# EAGLE design blumenland (EAGLE 7.2.0)
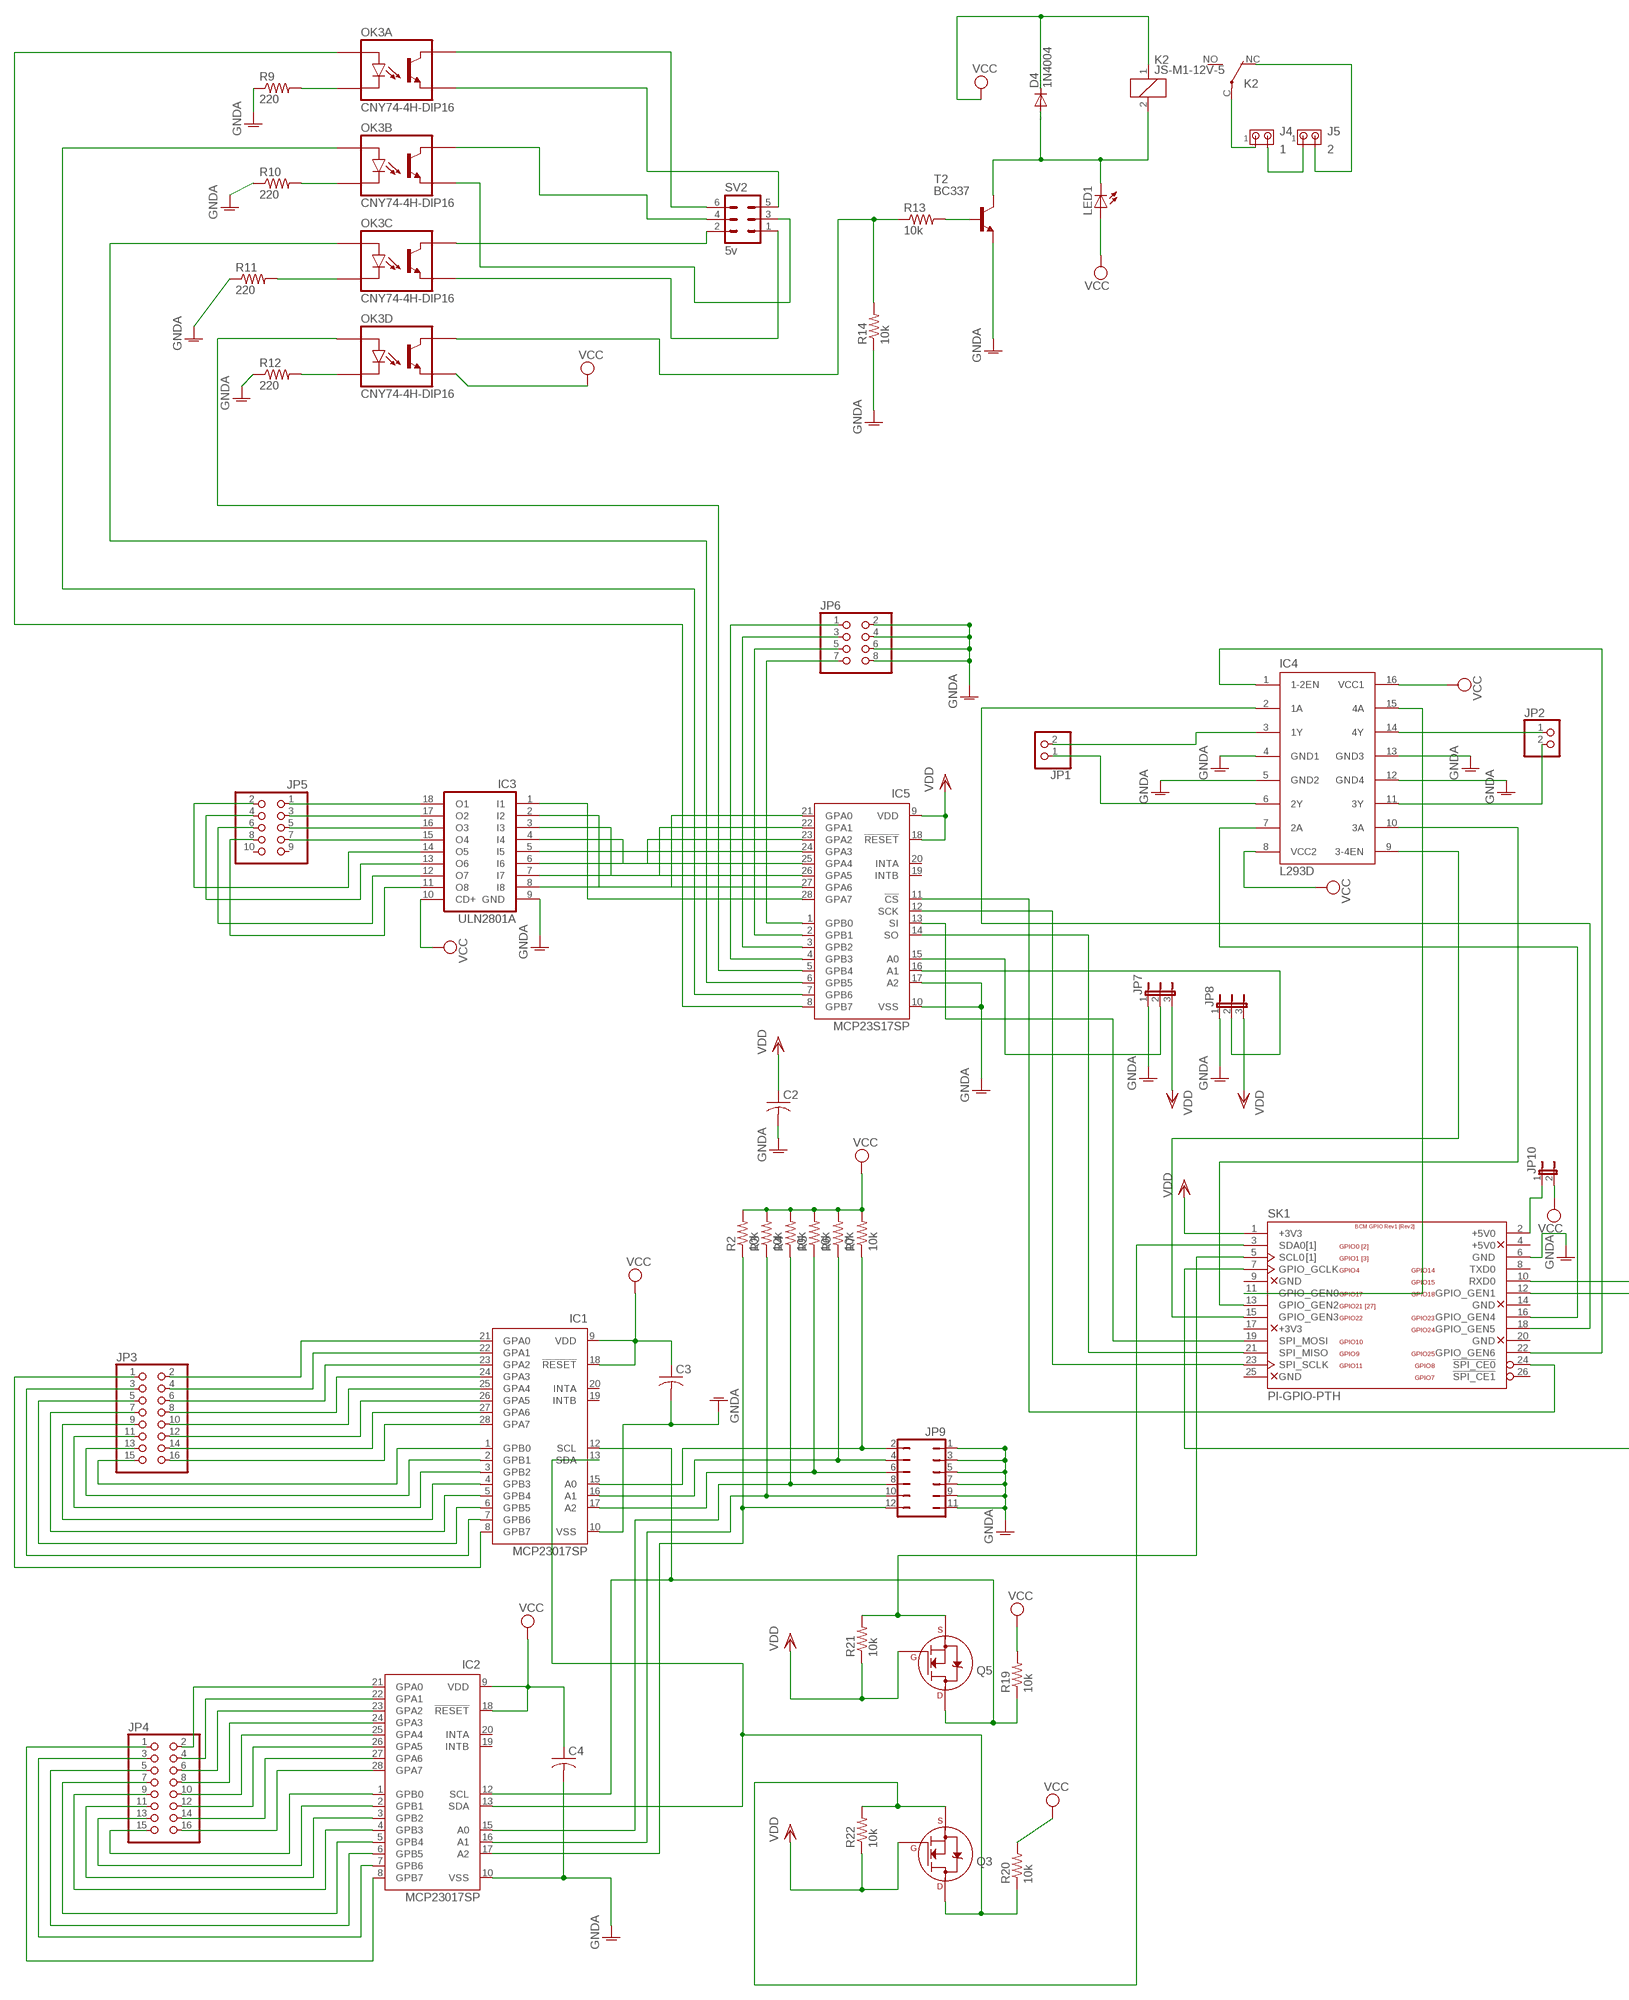
[diagram p0: schematic, sheet 1, part 1 of 2]
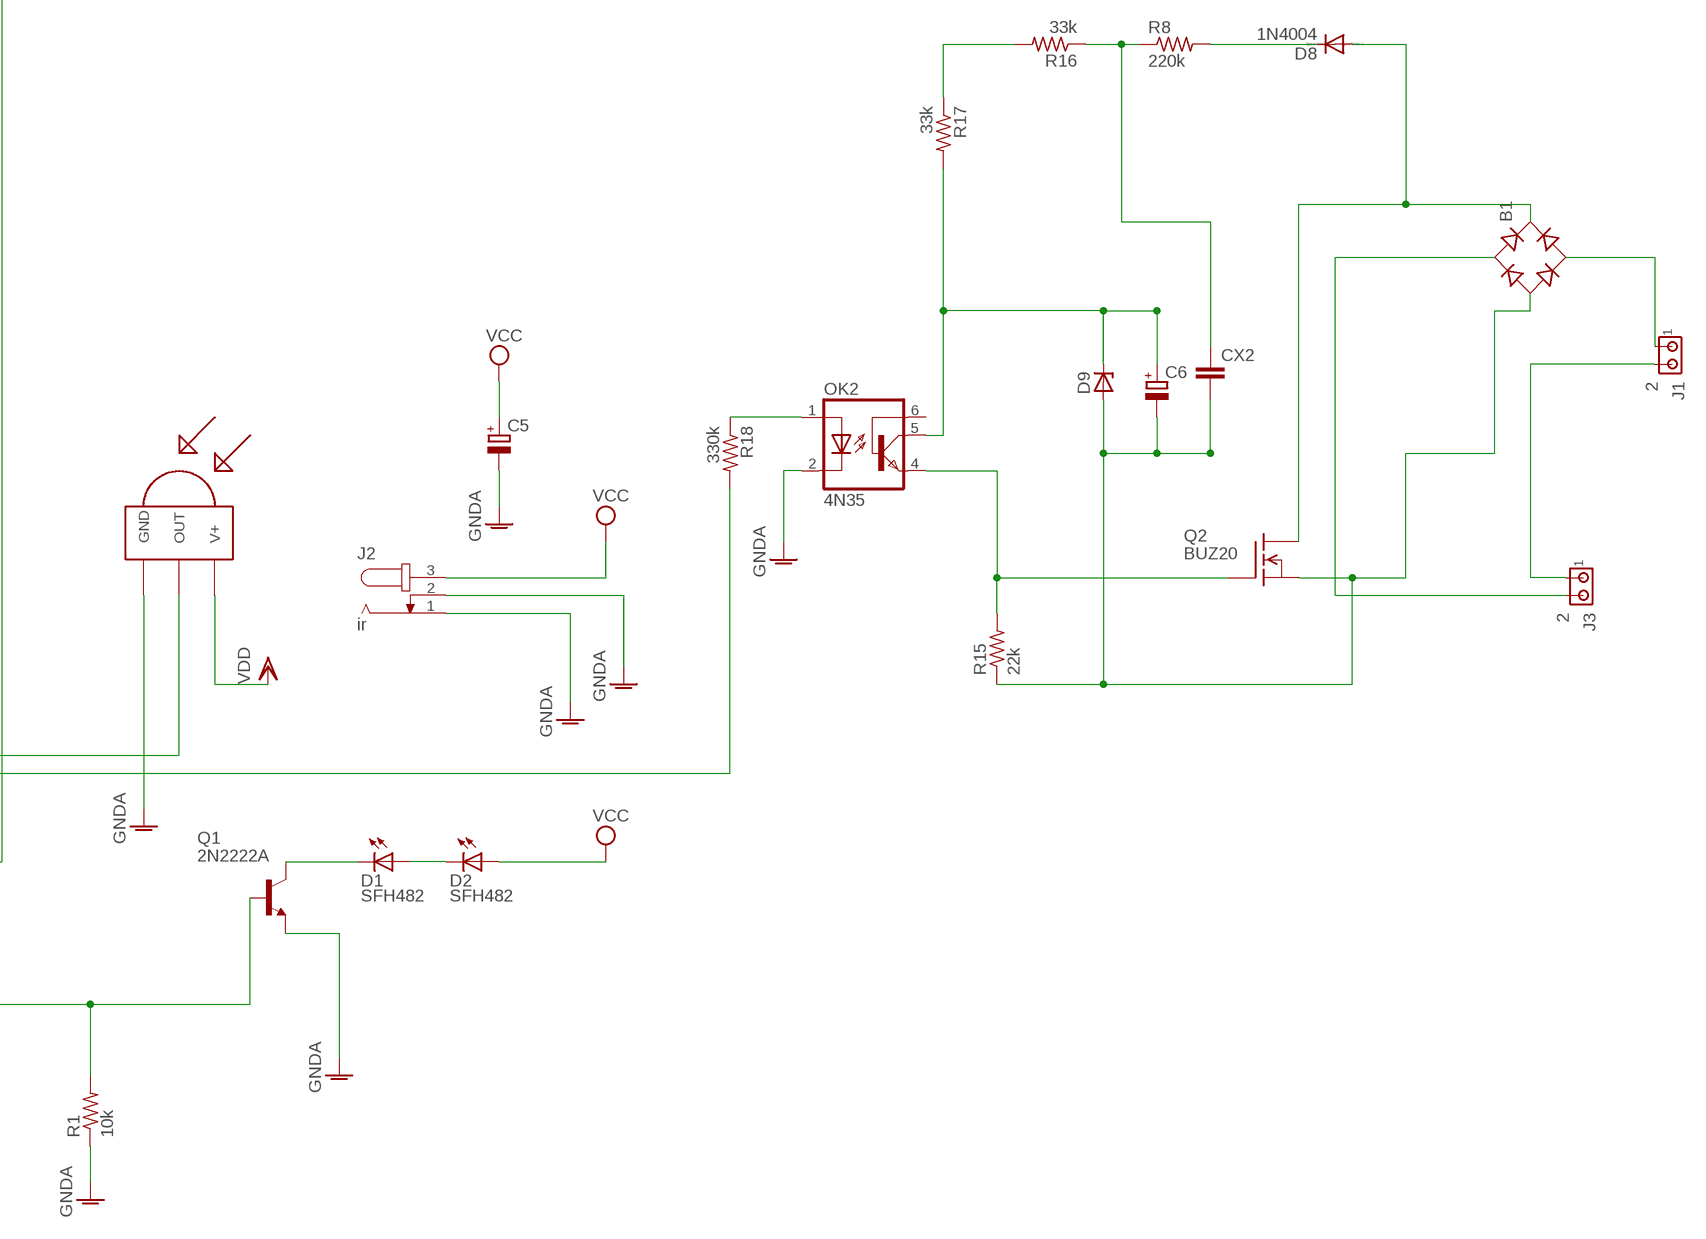
[diagram p1: schematic, sheet 1, part 2 of 2]

## Parts
B1  RB1A  [RB1A]
C2  C-US025-025X050  [C025-025X050]
C3  C-US025-025X050  [C025-025X050]
C4  C-US025-025X050  [C025-025X050]
C5  CPOL-EUE2-5  [E2-5]
C6  CPOL-EUE2.5-5  [E2,5-5]
CX2  CXXC10B6  [XC10B6]
D1  SFH482  [SFH482]
D2  SFH482  [SFH482]
D4  1N4004  [DO41-10]
D8  1N4004  [DO41-10]
D9  ZENER-DIODEDO41Z10  [DO41Z10]
IC1  MCP23017SP  [DIL28-3]
IC2  MCP23017SP  [DIL28-3]
IC3  ULN2801A  [DIL18]
IC4  L293D  [DIL16]
IC5  MCP23S17SP  [DIL28-3]
J1  2  MTA02-156  [1X2MTA]
J2  ir  JACK-PLUG0  [SPC4077]
J3  2  MTA02-156  [1X2MTA]
J4  1  MTA02-156  [1X2MTA]
J5  2  MTA02-156  [1X2MTA]
JP1  PINHD-1X2  [1X02]
JP2  PINHD-1X2  [1X02]
JP3  PINHD-2X8  [2X08]
JP4  PINHD-2X8  [2X08]
JP5  PINHD-2X5  [2X05]
JP6  PINHD-2X4  [2X04]
JP7  JP2E  [JP2]
JP8  JP2E  [JP2]
JP9  JP6Q  [JP6Q]
JP10  JP1E  [JP1]
K2  JS-M1-12V-5  [JS-M]
LED1  LED5MM  [LED5MM]
OK2  4N35  [DIL06]
OK3  CNY74-4H-DIP16  [DIL16-3]
Q1  2N2222A  [TO18]
Q2  BUZ20  [TO220]
Q3  2N7000_TO92  [TO-92]
Q5  2N7000_TO92  [TO-92]
R1  10k  R-US_0207/10  [0207/10]
R2  10k  R-US_0207/10  [0207/10]
R3  10k  R-US_0207/10  [0207/10]
R4  10k  R-US_0207/10  [0207/10]
R5  10k  R-US_0207/10  [0207/10]
R6  10k  R-US_0207/10  [0207/10]
R7  10k  R-US_0207/10  [0207/10]
R8  220k  R-US_0207/10  [0207/10]
R9  220  R-US_0204/7  [0204/7]
R10  220  R-US_0204/7  [0204/7]
R11  220  R-US_0204/7  [0204/7]
R12  220  R-US_0204/7  [0204/7]
R13  10k  R-US_0204/7  [0204/7]
R14  10k  R-US_0204/7  [0204/7]
R15  22k  R-US_0207/10  [0207/10]
R16  33k  R-US_0207/10  [0207/10]
R17  33k  R-US_0207/10  [0207/10]
R18  330k  R-US_0207/10  [0207/10]
R19  10k  R-US_0207/10  [0207/10]
R20  10k  R-US_0207/10  [0207/10]
R21  10k  R-US_0207/10  [0207/10]
R22  10k  R-US_0207/10  [0207/10]
SK1  PI-GPIO-PTH  [GPIO-CONNECTOR]
SV2  5v  MA03-2  [MA03-2]
T2  BC337  [TO92]
U$1  TSOP4838  [TSOP18XX]

## Nets
GNDA: C2.2 C3.2 C4.2 C5.- IC1.10(VSS) IC2.10(VSS) IC3.9(GND) IC4.4(GND1) IC4.5(GND2) IC4.12(GND4) IC4.13(GND3) IC5.10(VSS) IC5.17(A2) J2.1 J2.2 JP6.2 JP6.4 JP6.6 JP6.8 JP7.1 JP8.1 JP9.1 JP9.3 JP9.5 JP9.7 JP9.9 JP9.11 OK2.2(C) Q1.1(E) R1.1 R9.1 R10.1 R11.1 R12.1 R14.1 SK1.6(GND) T2.1(E) U$1.GND
N$1: SK1.10(RXD0) U$1.OUT
N$2: D1.A D2.K(C)
N$3: D1.K(C) Q1.3(C)
N$4: Q1.2(B) R1.2 SK1.7(GPIO_GCLK)
N$5: IC3.1(I1) IC5.28(GPA7)
N$6: IC3.2(I2) IC5.27(GPA6)
N$7: IC3.3(I3) IC5.26(GPA5)
N$8: IC3.4(I4) IC5.25(GPA4)
N$9: IC5.8(GPB7) OK3.1(A:A1)
N$10: IC5.7(GPB6) OK3.4(B:A1)
N$11: IC5.6(GPB5) OK3.5(C:A1)
N$12: IC5.5(GPB4) OK3.8(D:A1)
N$13: IC5.1(GPB0) JP6.7
N$14: IC5.2(GPB1) JP6.5
N$15: IC5.3(GPB2) JP6.3
N$16: IC5.4(GPB3) JP6.1
N$17: IC2.17(A2) JP9.12 R2.1
N$18: IC5.15(A0) JP7.2
N$19: IC5.16(A1) JP8.2
N$20: IC1.15(A0) JP9.2 R7.1
N$21: IC4.1(1-2EN) SK1.22(GPIO_GEN6)
N$22: IC1.16(A1) JP9.4 R6.1
N$23: IC3.5(I5) IC5.24(GPA3)
N$24: IC4.2(1A) SK1.18(GPIO_GEN5)
N$25: IC1.17(A2) JP9.6 R5.1
N$26: IC4.3(1Y) JP1.2
N$27: IC4.6(2Y) JP1.1
N$28: IC4.14(4Y) JP2.1
N$29: IC4.11(3Y) JP2.2
N$30: IC4.7(2A) SK1.16(GPIO_GEN4)
N$31: IC3.6(I6) IC5.23(GPA2)
N$32: IC4.15(4A) SK1.11(GPIO_GEN0)
N$33: IC2.2(GPB1) JP4.13
N$34: IC1.22(GPA1) JP3.4
N$35: IC4.10(3A) SK1.13(GPIO_GEN2)
N$36: IC4.9(3-4EN) SK1.15(GPIO_GEN3)
N$37: IC3.7(I7) IC5.22(GPA1)
N$38: IC3.8(I8) IC5.21(GPA0)
N$39: IC1.21(GPA0) JP3.2
N$40: IC2.15(A0) JP9.8 R4.1
N$41: IC1.23(GPA2) JP3.6
N$42: IC1.24(GPA3) JP3.8
N$43: IC2.16(A1) JP9.10 R3.1
N$44: IC1.25(GPA4) JP3.10
N$45: IC1.26(GPA5) JP3.12
N$46: IC1.27(GPA6) JP3.14
N$47: IC1.28(GPA7) JP3.16
N$48: IC1.2(GPB1) JP3.13
N$49: IC1.1(GPB0) JP3.15
N$50: IC1.3(GPB2) JP3.11
N$51: IC1.4(GPB3) JP3.9
N$52: IC1.5(GPB4) JP3.7
N$53: IC1.6(GPB5) JP3.5
N$54: IC1.7(GPB6) JP3.3
N$55: IC1.8(GPB7) JP3.1
N$56: IC2.21(GPA0) JP4.2
N$57: IC2.22(GPA1) JP4.4
N$58: IC2.23(GPA2) JP4.6
N$59: IC2.24(GPA3) JP4.8
N$60: IC2.25(GPA4) JP4.10
N$61: IC2.26(GPA5) JP4.12
N$62: IC2.27(GPA6) JP4.14
N$63: IC2.28(GPA7) JP4.16
N$64: IC2.1(GPB0) JP4.15
N$65: IC2.3(GPB2) JP4.11
N$66: IC3.18(O1) JP5.1
N$67: IC2.4(GPB3) JP4.9
N$68: IC2.5(GPB4) JP4.7
N$69: IC2.6(GPB5) JP4.5
N$70: IC2.7(GPB6) JP4.3
N$71: IC2.8(GPB7) JP4.1
N$72: IC3.17(O2) JP5.3
N$73: IC3.16(O3) JP5.5
N$74: IC3.15(O4) JP5.7
N$75: IC3.14(O5) JP5.2
N$76: IC5.13(SI) SK1.19(SPI_MOSI)
N$77: IC5.14(SO) SK1.21(SPI_MISO)
N$78: IC5.12(SCK) SK1.23(SPI_SCLK)
N$79: IC5.11(!CS) SK1.24(!SPI_CE0)
N$80: IC3.13(O6) JP5.4
N$81: IC3.12(O7) JP5.6
N$82: IC3.11(O8) JP5.8
N$84: OK3.2(A:C1) R9.2
N$85: OK3.6(C:C1) R11.2
N$86: OK3.3(B:C1) R10.2
N$87: OK3.16(A:EMITTER1) SV2.5
N$88: OK3.13(B:EMITTER1) SV2.3
N$89: OK3.12(C:EMITTER1) SV2.1
N$90: OK3.9(D:COLLECTOR1) R13.1 R14.2
N$91: R13.2 T2.2(B)
N$92: D4.A K2.2 LED1.K(C) T2.3(C)
N$93 [potencia]: J4.1 K2.C(2:P)
N$94: OK3.7(D:C1) R12.2
N$95 [potencia]: J5.2 K2.NC(2:O)
N$96 [potencia]: J4.2 J5.1
N$97: OK3.11(C:COLLECTOR1) SV2.2
N$98: OK3.14(B:COLLECTOR1) SV2.4
N$99: OK3.15(A:COLLECTOR1) SV2.6
N$102: B1.AC1 J3.2
N$103: B1.AC2 J1.1
N$104: B1.+ D8.A Q2.2(D)
N$105: R16.2 R17.1
N$106: CX2.1 R8.1 R16.1
N$107: OK2.4(EMI) Q2.1(G) R15.2
N$109: D8.C R8.2
N$110: C6.+ D9.C OK2.5(COL) R17.2
N$111: R18.2 SK1.12(GPIO_GEN1)
N$112: OK2.1(A) R18.1
N$113: J1.2 J3.1
N$114: JP10.1 SK1.2(+5V0)
N$117: Q5.1(S) R21.2 SK1.5(SCL0)
N$118: Q3.1(S) R22.2 SK1.3(SDA0)
N$119: B1.- C6.- CX2.2 D9.A Q2.3(S) R15.1
N$120: IC1.13(SDA) IC2.13(SDA) Q3.3(D) R20.1
N$121: IC1.12(SCL) IC2.12(SCL) Q5.3(D) R19.1
VCC: C3.1 C4.1 C5.+ D2.A D4.C IC1.9(VDD) IC1.18(!RESET) IC2.9(VDD) IC2.18(!RESET) IC3.10(CD+) IC4.8(VCC2) IC4.16(VCC1) J2.3 JP10.2 K2.1 LED1.A OK3.10(D:EMITTER1) R2.2 R3.2 R4.2 R5.2 R6.2 R7.2 R19.2 R20.2
VDD: C2.1 IC5.9(VDD) IC5.18(!RESET) JP7.3 JP8.3 Q3.2(G) Q5.2(G) R21.1 R22.1 SK1.1(+3V3) U$1.VCC(V+)
Unconnected: IC1.19(INTB) IC1.20(INTA) IC2.19(INTB) IC2.20(INTA) IC5.19(INTB) IC5.20(INTA) JP5.9 JP5.10 K2.NO(2:S) OK2.6(BAS) SK1.4(+5V0) SK1.8(TXD0) SK1.9(GND) SK1.14(GND) SK1.17(+3V3) SK1.20(GND) SK1.25(GND) SK1.26(!SPI_CE1)

## Library data of the parts
B1 = rectifier:RB1A: RECTIFIER 1 A
C2-C4 = rcl:C-US: CAPACITOR, American symbol
C5 C6 = rcl:CPOL-EU: POLARIZED CAPACITOR, European symbol
CX2 = rcl:CX: X CAPACITOR for power line
D1 D2 = led:SFH482: IR LED infrared emitting diode, Infineon
D4 D8 = diode:1N4004: DIODE general purpose rectifier, 1 A
D9 = diode:ZENER-DIODE: Z-Diode
IC1 IC2 = microchip:MCP23017: http://ww1.microchip.com/downloads/en/DeviceDoc/21952a.pdf Source: http://ww1.microchip.com/downloads/en/DeviceDoc/21952a.pdf; MF: MICROCHIP; MPN: MCP23017-E/SP; OC_FARNELL: 1332088; OC_NEWARK: 31K2959
IC3 = uln-udn:ULN2801A: DRIVER ARRAY
IC4 = st-microelectronics:L293D: PUSH-PULL 4 CHANNEL DRIVER; MPN: L293D; OC_FARNELL: 9589619; OC_NEWARK: 56P8249
IC5 = microchip:MCP23S17: http://ww1.microchip.com/downloads/en/DeviceDoc/21952a.pdf Source: http://ww1.microchip.com/downloads/en/DeviceDoc/21952a.pdf; MF: MICROCHIP; MPN: MCP23S17-E/SP; OC_FARNELL: 1292238; OC_NEWARK: 31K2951
J1 J3-J5 = con-amp:MTA02-156: AMP connector
J2 = con-jack:JACK-PLUG: DC POWER JACK Power Jack, DC, Right Angle, Through Hole, Rated 5A at 16VDC, PC Terminals Distributor: Farnell (www.Farnell.de) Drawing: 84N1161.pdf / 84N1162.pdf Manufacturer: SPC Technology (www.spctechnology.com) Type: SPC4077 / SPC 4078; OC_FARNELL: unknown; OC_NEWARK: unknown
JP1 JP2 = pinhead:PINHD-1X2: PIN HEADER
JP3 JP4 = pinhead:PINHD-2X8: PIN HEADER
JP5 = pinhead:PINHD-2X5: PIN HEADER
JP6 = pinhead:PINHD-2X4: PIN HEADER
JP7 JP8 = jumper:JP2E: JUMPER
JP9 = jumper:JP6Q: JUMPER
JP10 = jumper:JP1E: JUMPER
K2 = relay:JS-M1*: Automotive Ultra-Miniature Power Relay NAiS Source: http://www.mew-europe.com/.. en_ds_61211_0000.pdf; MF: FARNELL; MPN: JSM1-12V-5; OC_FARNELL: 910351; OC_NEWARK: 14J1764
LED1 = adafruit:LED: LED OSRAM: - CHIPLED LG R971, LG N971, LY N971, LG Q971, LY Q971, LO R971, LY R971 LH N974, LH R974 LS Q976, LO Q976, LY Q976 LO Q996 - Hyper CHIPLED LW Q18S LB Q993, LB Q99A, LB R99A - SideLED LS A670, LO A670, LY A670, LG A670, LP A670 LB A673, LV A673, LT A673, LW A673 LH A674 LY A675 LS A676, LA A676, LO A676, LY A676, LW A676 LS A679, LY A679, LG A679 - Hyper Micro SIDELED® LS Y876, LA Y876, LO Y876, LY Y876 LT Y87S - SmartLED LW L88C, LW L88S LB L89C, LB L89S, LG L890 LS L89K, LO L89K, LY L89K LS L896, LA L896, LO L896, LY L896 - TOPLED LS T670, LO T670, LY T670, LG T670, LP T670 LSG T670, LSP T670, LSY T670, LOP T670, LYG T670 LG T671, LOG T671, LSG T671 LB T673, LV T673, LT T673, LW T673 LH T674 LS T676, LA T676, LO T676, LY T676, LB T676, LH T676, LSB T676, LW T676 LB T67C, LV T67C, LT T67C, LS T67K, LO T67K, LY T67K, LW E67C LS E67B, LA E67B, LO E67B, LY E67B, LB E67C, LV E67C, LT E67C LW T67C LS T679, LY T679, LG T679 LS T770, LO T770, LY T770, LG T770, LP T770 LB T773, LV T773, LT T773, LW T773 LH T774 LS E675, LA E675, LY E675, LS T675 LS T776, LA T776, LO T776, LY T776, LB T776 LHGB T686 LT T68C, LB T68C - Hyper Mini TOPLED® LB M676 - Mini TOPLED Santana® LG M470 LS M47K, LO M47K, LY M47K Source: http://www.osram.convergy.de/
OK2 = optocoupler:4N35: MOTOROLA OPTO COUPLER; MF: FAIRCHILD SEMICONDUCTOR; MPN: 4N35; OC_FARNELL: 1328375; OC_NEWARK: 72K9946
OK3 = tidyeagle:CNY74-4H: 4-Channel Phototransistor Optocoupler Datasheet: Full <http://www.vishay.com/docs/83526/83526.pdf>
Q1 = transistor-npn:2N2222*: NPN Transistor
Q2 = transistor-fet:BUZ20: N-Channel Enhancement MOSFET 100V; 12A; 0,2Ohm
Q3 Q5 = transistors:2N700*: 2N7000, 2N7002, NDS7002A N-channel enhancement mode MOSFET
R1-R22 = resistor:R-US_: RESISTOR, American symbol
SK1 = jt-raspberry-pi:PI-: Raspberry Pi
SV2 = con-lstb:MA03-2: PIN HEADER; OC_FARNELL: unknown; OC_NEWARK: unknown
T2 = transistor:BC337: NPN TRANSISTOR
U$1 = tsop:TSOP4838: IR Receiver and Demodulator

## Net classes
0 default: width 0.635 mm
1 potencia: width 1.778 mm

## Board
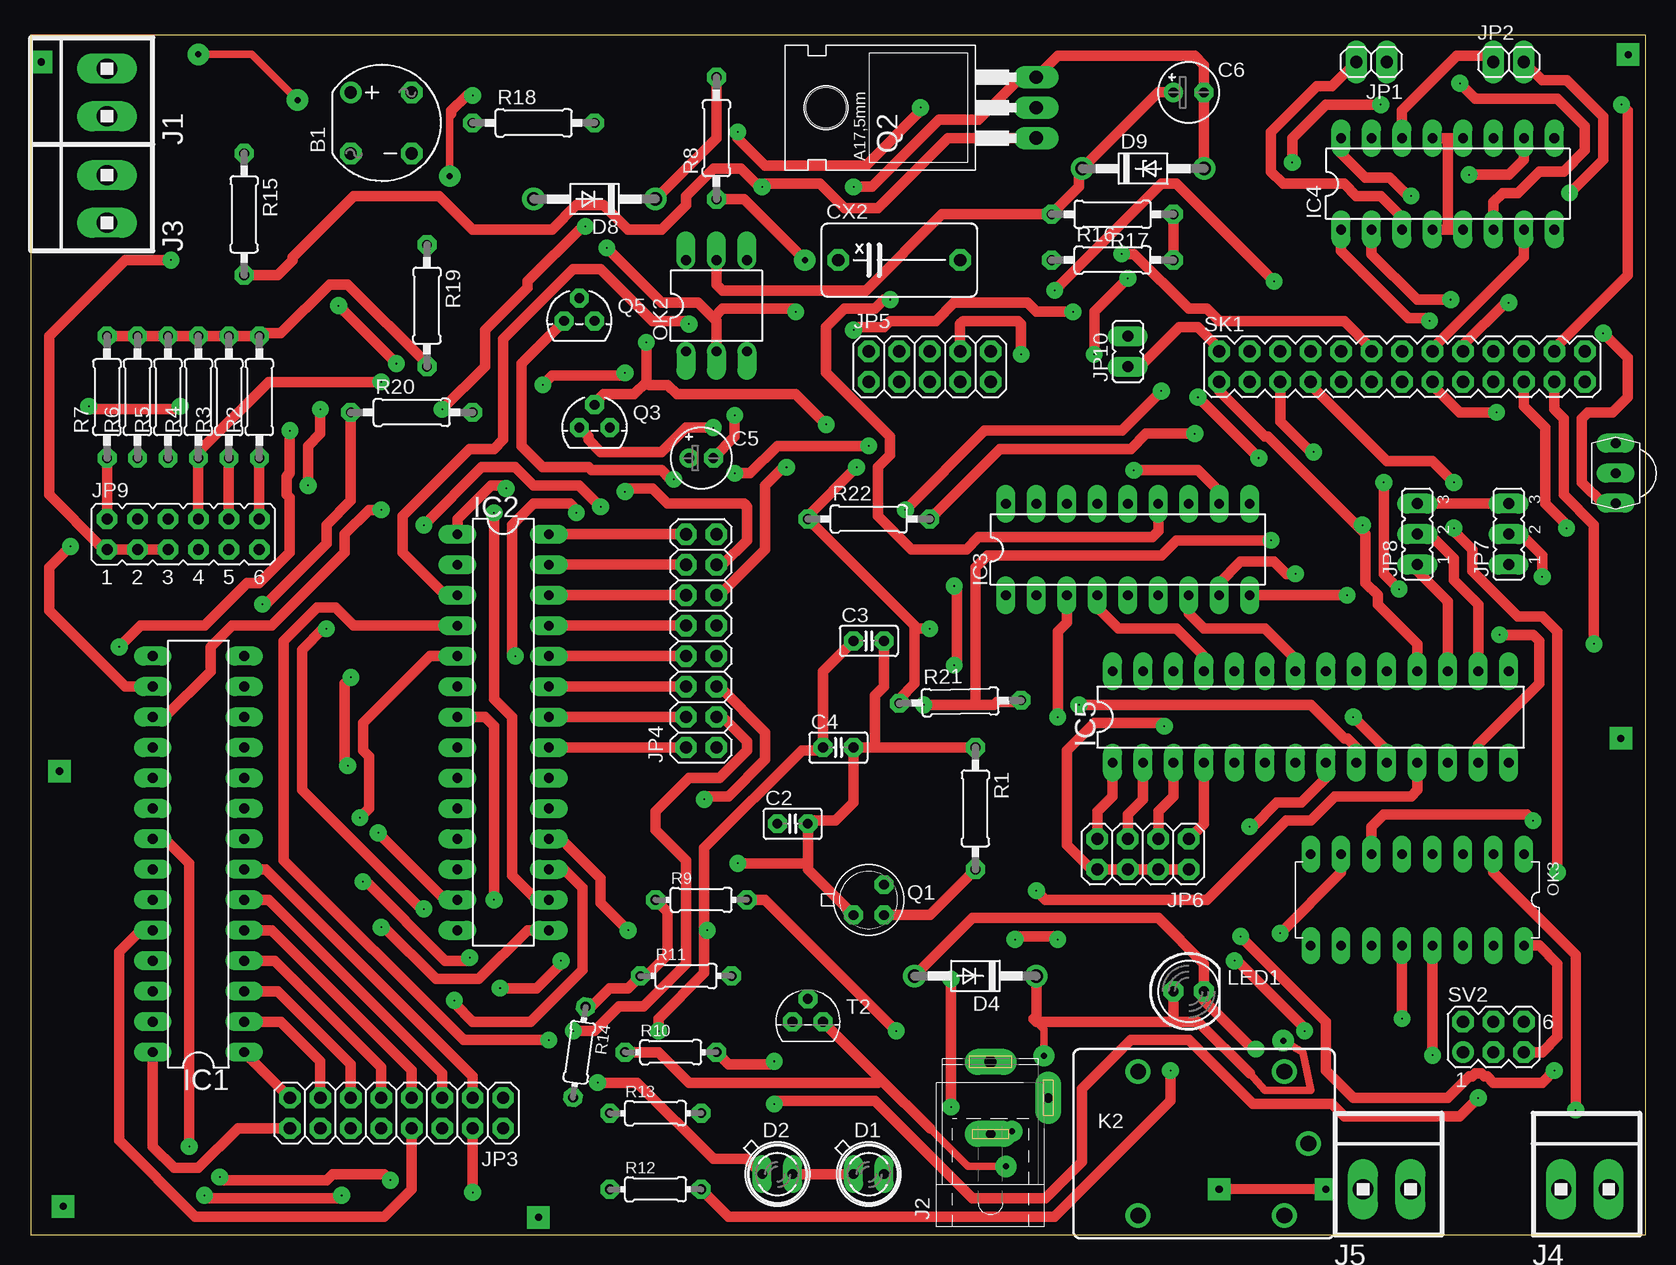
[diagram p2: board, top side]
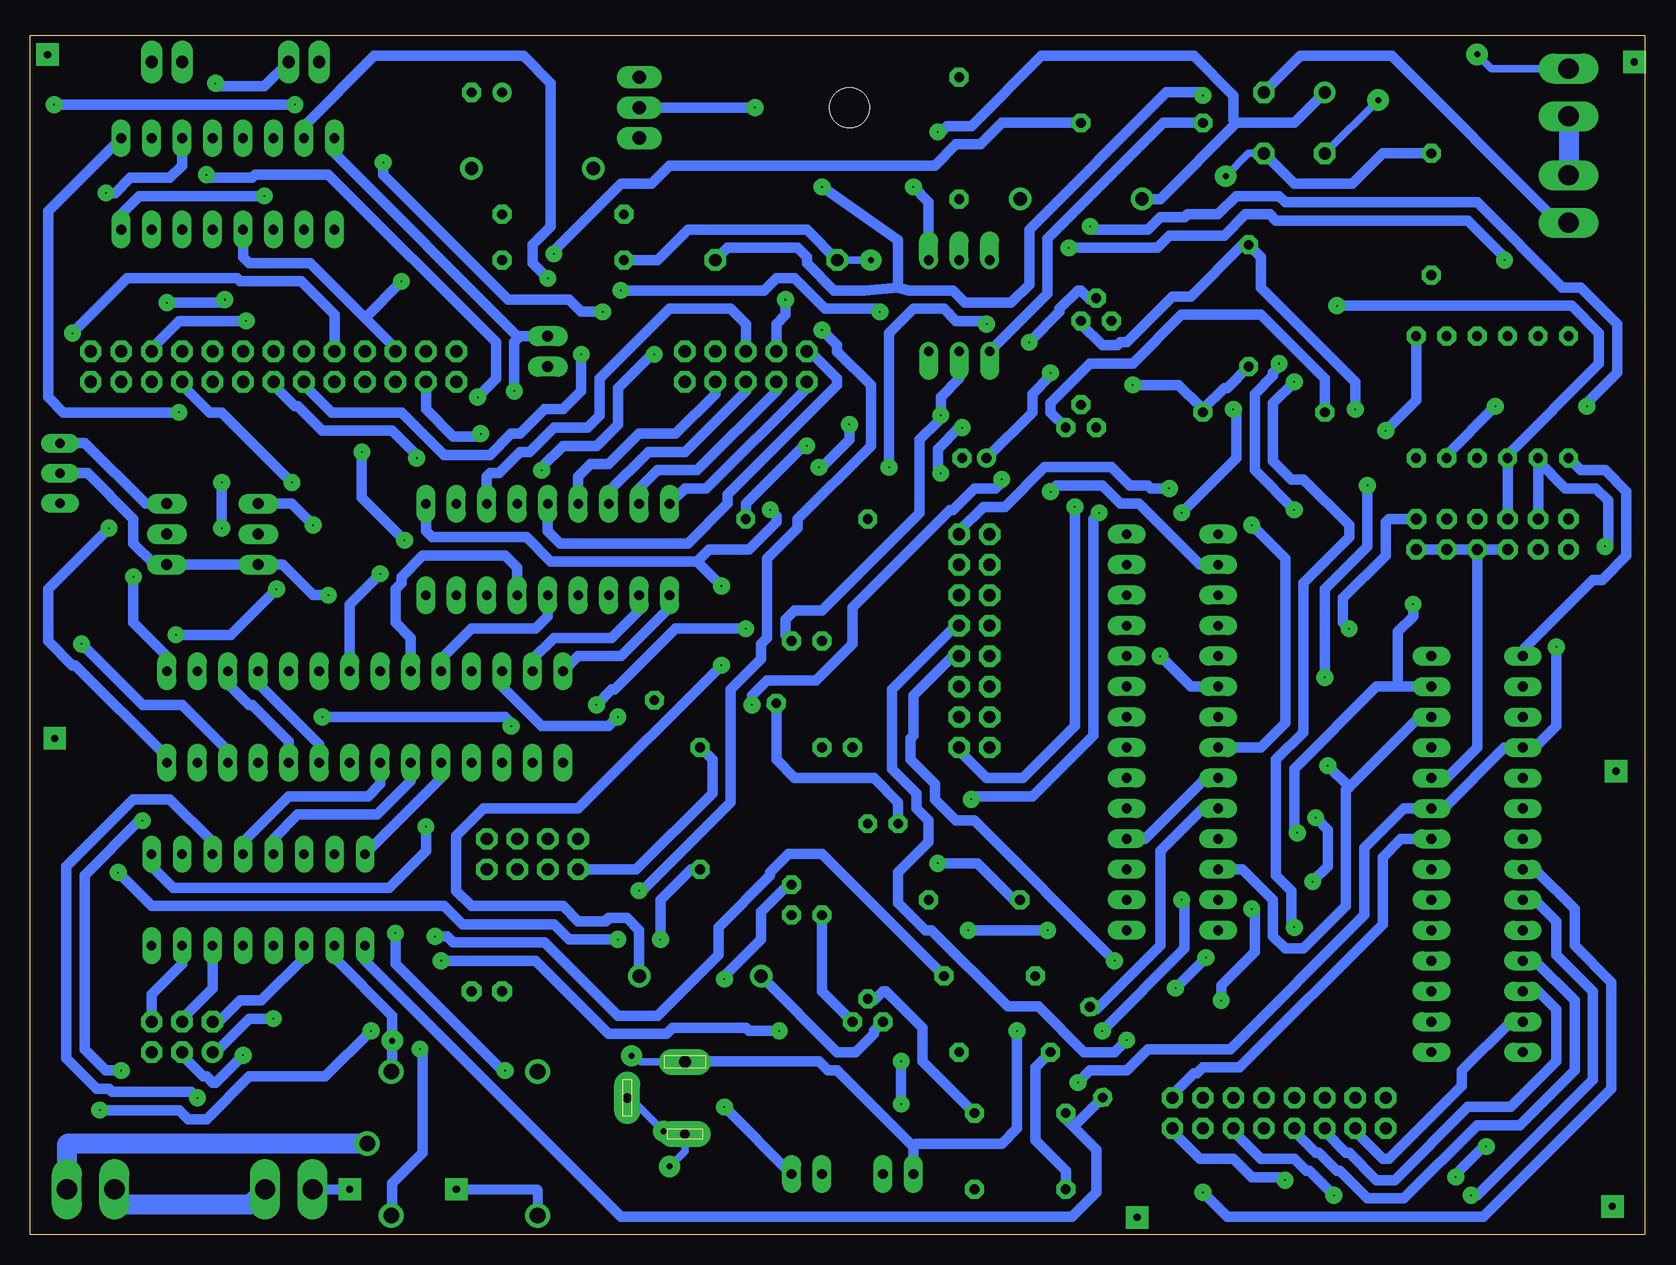
[diagram p3: board, bottom side, seen from below]

Size 134.6 x 100 mm. Coordinates in mm from the lower left corner, seen from the top.
Outline: 0,0 134.6,0 134.6,100 0,100 0,0
Copper layers (1*16): Top 0.035mm / dielectric 1.5mm / Bottom 0.035mm
Design rules "default *": minimum track width 35mil, minimum drill 5mil, track to track 25mil, track to pad 25mil, pad to pad 20mil, via to via 20mil, smd to smd 15mil, copper to edge 40mil, drill to drill 25mil, minimum pad ring 15mil, minimum via ring 25mil, stop-mask expansion 4mil, vias tented up to drill 0mil, thermal gap 10mil

### Footprints (pad centres in the part's own frame; a part is rotated, then mirrored left to right if it is on the bottom)
RB1A = drill 1.016: + -2.54,2.54 | drill 1.016 octagon: - 2.54,-2.54; AC1 2.54,2.54; AC2 -2.54,-2.54
C025-025X050 = drill 0.813 octagon: 1 -1.27,0; 2 1.27,0
E2-5 = drill 0.813 pad 1.27: + -1.016,0 | drill 0.813 pad 1.27 octagon: - 1.016,0
E2,5-5 = drill 0.813 pad 1.6: + -1.27,0 | drill 0.813 pad 1.6 octagon: - 1.27,0
XC10B6 = drill 1.016 octagon: 1 -5.08,0; 2 5.08,0
SFH482 = drill 0.813 long: A -1.27,0; K 1.27,0
DO41-10 = drill 1.118: A 5.08,0; C -5.08,0
DO41Z10 = drill 1.118: A 5.08,0; C -5.08,0
DIL28-3 = drill 0.813 long: 1 -16.51,-3.81; 2 -13.97,-3.81; 3 -11.43,-3.81; 4 -8.89,-3.81; 5 -6.35,-3.81; 6 -3.81,-3.81; 7 -1.27,-3.81; 8 1.27,-3.81; 9 3.81,-3.81; 10 6.35,-3.81; 11 8.89,-3.81; 12 11.43,-3.81; 13 13.97,-3.81; 14 16.51,-3.81; 15 16.51,3.81; 16 13.97,3.81; 17 11.43,3.81; 18 8.89,3.81; 19 6.35,3.81; 20 3.81,3.81; 21 1.27,3.81; 22 -1.27,3.81; 23 -3.81,3.81; 24 -6.35,3.81; 25 -8.89,3.81; 26 -11.43,3.81; 27 -13.97,3.81; 28 -16.51,3.81
DIL18 = drill 0.813 long: 1 -10.16,-3.81; 2 -7.62,-3.81; 3 -5.08,-3.81; 4 -2.54,-3.81; 5 0,-3.81; 6 2.54,-3.81; 7 5.08,-3.81; 8 7.62,-3.81; 9 10.16,-3.81; 10 10.16,3.81; 11 7.62,3.81; 12 5.08,3.81; 13 2.54,3.81; 14 0,3.81; 15 -2.54,3.81; 16 -5.08,3.81; 17 -7.62,3.81; 18 -10.16,3.81
DIL16 = drill 0.813 long: 1 -8.89,-3.81; 2 -6.35,-3.81; 3 -3.81,-3.81; 4 -1.27,-3.81; 5 1.27,-3.81; 6 3.81,-3.81; 7 6.35,-3.81; 8 8.89,-3.81; 9 8.89,3.81; 10 6.35,3.81; 11 3.81,3.81; 12 1.27,3.81; 13 -1.27,3.81; 14 -3.81,3.81; 15 -6.35,3.81; 16 -8.89,3.81
1X2MTA = drill 1.676 long: 1 1.981,0; 2 -1.981,0
SPC4077 = drill 0.8 pad 2.184 long: 1 -3,0; 2 0,-4.8 | drill 1 pad 2.184 long: 3 3,0
1X02 = drill 1.016 long: 1 -1.27,0; 2 1.27,0
2X08 = drill 1.016 octagon: 1 -8.89,-1.27; 2 -8.89,1.27; 3 -6.35,-1.27; 4 -6.35,1.27; 5 -3.81,-1.27; 6 -3.81,1.27; 7 -1.27,-1.27; 8 -1.27,1.27; 9 1.27,-1.27; 10 1.27,1.27; 11 3.81,-1.27; 12 3.81,1.27; 13 6.35,-1.27; 14 6.35,1.27; 15 8.89,-1.27; 16 8.89,1.27
2X05 = drill 1.016 octagon: 1 -5.08,-1.27; 2 -5.08,1.27; 3 -2.54,-1.27; 4 -2.54,1.27; 5 0,-1.27; 6 0,1.27; 7 2.54,-1.27; 8 2.54,1.27; 9 5.08,-1.27; 10 5.08,1.27
2X04 = drill 1.016 octagon: 1 -3.81,-1.27; 2 -3.81,1.27; 3 -1.27,-1.27; 4 -1.27,1.27; 5 1.27,-1.27; 6 1.27,1.27; 7 3.81,-1.27; 8 3.81,1.27
JP2 = drill 0.914 long: 1 -2.54,0; 2 0,0; 3 2.54,0
JP6Q = drill 0.914 octagon: 1 -6.35,-1.27; 2 -6.35,1.27; 3 -3.81,-1.27; 4 -3.81,1.27; 5 -1.27,-1.27; 6 -1.27,1.27; 7 1.27,-1.27; 8 1.27,1.27; 9 3.81,-1.27; 10 3.81,1.27; 11 6.35,-1.27; 12 6.35,1.27
JP1 = drill 0.914 long: 1 0,-1.27; 2 0,1.27
JS-M = drill 1.3: 1 6.7,6; 2 6.7,-6; C 8.7,0; NC -5.5,-6; NO -5.5,6
LED5MM = drill 0.813 pad 1.676 octagon: A -1.27,0; K 1.27,0
DIL06 = drill 0.813 offset: 1 -2.54,-3.81; 2 0,-3.81; 3 2.54,-3.81; 4 2.54,3.81; 5 0,3.81; 6 -2.54,3.81
DIL16-3 = drill 0.8 long: 1 -8.89,-3.81; 2 -6.35,-3.81; 3 -3.81,-3.81; 4 -1.27,-3.81; 5 1.27,-3.81; 6 3.81,-3.81; 7 6.35,-3.81; 8 8.89,-3.81; 9 8.89,3.81; 10 6.35,3.81; 11 3.81,3.81; 12 1.27,3.81; 13 -1.27,3.81; 14 -3.81,3.81; 15 -6.35,3.81; 16 -8.89,3.81
TO18 = drill 0.813 octagon: 1 -1.27,-1.27; 2 1.27,-1.27; 3 1.27,1.27
TO220 = drill 1.118 long: 1 -2.54,-6.35; 2 0,-6.35; 3 2.54,-6.35 | hole 3.302: 0,11.176
TO-92 = drill 0.813 octagon: 1 -1.27,0; 2 0,1.905; 3 1.27,0
0207/10 = drill 0.813 octagon: 1 -5.08,0; 2 5.08,0
0204/7 = drill 0.813 octagon: 1 -3.81,0; 2 3.81,0
GPIO-CONNECTOR = drill 1.016 pad 1.676 octagon: 1 -15.24,-1.27; 2 -15.24,1.27; 3 -12.7,-1.27; 4 -12.7,1.27; 5 -10.16,-1.27; 6 -10.16,1.27; 7 -7.62,-1.27; 8 -7.62,1.27; 9 -5.08,-1.27; 10 -5.08,1.27; 11 -2.54,-1.27; 12 -2.54,1.27; 13 0,-1.27; 14 0,1.27; 15 2.54,-1.27; 16 2.54,1.27; 17 5.08,-1.27; 18 5.08,1.27; 19 7.62,-1.27; 20 7.62,1.27; 21 10.16,-1.27; 22 10.16,1.27; 23 12.7,-1.27; 24 12.7,1.27; 25 15.24,-1.27; 26 15.24,1.27
MA03-2 = drill 1.016: 1 -2.54,-1.27 | drill 1.016 octagon: 2 -2.54,1.27; 3 0,-1.27; 4 0,1.27; 5 2.54,-1.27; 6 2.54,1.27
TO92 = drill 0.813 octagon: 1 1.27,0; 2 0,1.905; 3 -1.27,0
TSOP18XX = drill 0.813 long: GND -0.001,-0.027; OUT -2.501,-0.027; VCC 2.499,-0.027

### Placement (x,y rotation side)
B1  29.21,92.71 0 top
C2  63.5,34.29 0 top
C3  69.85,49.53 0 top
C4  67.31,40.64 0 top
C5  55.88,64.77 0 top
C6  96.52,95.25 0 top
CX2  72.39,81.28 0 top
D1  69.85,5.08 0 top
D2  62.23,5.08 0 top
D4  78.74,21.59 180 top
D8  46.99,86.36 180 top
D9  92.71,88.9 0 top
IC1  13.97,31.75 90 top
IC2  39.37,41.91 270 top
IC3  91.44,57.15 0 top
IC4  118.11,87.63 0 top
IC5  106.68,43.18 0 top
J1  6.35,95.25 90 top
J2  80.01,11.43 90 top
J3  6.35,86.36 90 top
J4  129.54,3.81 0 top
J5  113.03,3.81 0 top
JP1  111.76,97.79 180 top
JP2  123.19,97.79 0 top
JP3  30.48,10.16 180 top
JP4  55.88,49.53 90 top
JP5  74.93,72.39 0 top
JP6  92.71,31.75 180 top
JP7  123.19,58.42 90 top
JP8  115.57,58.42 90 top
JP9  12.7,58.42 0 top
JP10  91.44,73.66 0 top
K2  97.79,7.62 0 top
LED1  96.52,20.32 0 top
OK2  57.15,77.47 0 top
OK3  115.57,27.94 180 top
Q1  69.85,27.94 0 top
Q2  77.47,93.98 90 top
Q3  46.99,67.31 0 top
Q5  45.72,76.2 0 top
R1  78.74,35.56 270 top
R2  19.05,69.85 90 top
R3  16.51,69.85 90 top
R4  13.97,69.85 90 top
R5  11.43,69.85 90 top
R6  8.89,69.85 90 top
R7  6.35,69.85 90 top
R8  57.15,91.44 90 top
R9  10k  [0204/7]  55.88,27.94 0 top
R10  10k  [0204/7]  53.34,15.24 0 top
R11  10k  [0204/7]  54.61,21.59 0 top
R12  10k  [0204/7]  52.07,3.81 0 top
R13  52.07,10.16 0 top
R14  45.72,15.24 262 top
R15  17.78,85.09 270 top
R16  90.17,81.28 0 top
R17  90.17,85.09 180 top
R18  41.91,92.71 0 top
R19  33.02,77.47 270 top
R20  31.75,68.58 0 top
R21  77.47,44.45 1.4 top
R22  69.85,59.69 0 top
SK1  114.3,72.39 0 top
SV2  121.92,16.51 0 top
T2  64.77,17.78 0 top
U$1  132.08,63.5 90 top

### Tracks (layer width: path | path; a pad name or v marks a point on that pad's centre or on a via)
GNDA  (via drill 0.13, 0.5 pad 1.27)
  Top 0.61: 74.93,8.89 78.11,5.71 v81.28,5.71
  Top 0.889: v109.73,53.34 IC3.9 | IC5.17 118.11,52.83 115.57,55.37 JP8.1 | IC4.12 118.11,91.44 | 118.11,91.44 IC4.13 | IC4.5 118.11,83.82 | 118.11,83.82 IC4.4 | 118.11,83.82 118.11,91.44 | R14.1 46.48,19.05 46.74,19.05 48.26,20.57 49.78,20.57 R11.1 51.05,21.34 53.09,23.37 53.09,26.92 R9.1 | JP9.5 JP9.3 JP9.1 6.1,57.4 5.84,57.4 1.52,61.72 1.52,74.93 7.87,81.28 v11.68,81.28 | v81.79,8.64 80.01,8.64 J2.1 79.76,8.89 | 84.58,11.43 J2.2 | C5.- 58.67,66.55 v58.67,68.33 | JP6.2 JP6.4 JP6.6 JP6.8 88.65,30.23 86.36,32.51 86.36,40.39 88.65,42.67 94.23,42.67 v94.49,42.42 | 64.77,30.99 64.77,30.48 Q1.1 | 64.77,30.99 C2.2 65.02,34.54 67.06,34.54 68.58,36.07 C4.2 70.36,40.64 | 70.36,40.64 R1.1 | C3.2 71.12,45.72 70.36,44.96 70.36,40.64 | T2.1 70.87,12.95 | 70.87,12.95 74.93,8.89 | R10.1 52.32,15.24 54.86,12.7 70.61,12.7 70.87,12.95 | v48.01,82.3 52.58,77.72 55.63,77.72 56.9,76.45 | 56.9,76.45 57.15,76.2 OK2.2 | 64.77,30.99 v58.93,30.99 | v103.63,79.5 95.5,87.63 94.23,87.63 v85.34,78.74 | v63.75,76.96 63.5,77.22 57.66,77.22 56.9,76.45 | IC5.10 113.03,40.39 v110.24,43.18
  Bottom 0.61: v81.79,8.64 84.58,11.43 J2.2 | v81.28,5.71 80.01,6.99 J2.1
  Bottom 0.889: U$1.GND 132.08,63.5 129.79,63.5 125.98,59.69 125.98,57.66 124.21,55.88 JP7.1 JP8.1 113.54,55.88 111,53.34 v109.73,53.34 | IC5.10 113.03,41.15 116.08,44.2 116.33,44.2 118.11,45.97 IC5.17 | SK1.6 104.14,73.91 106.68,76.45 | 106.68,76.45 111.25,81.03 116.33,81.03 116.84,81.53 IC4.4 | IC2.10 36.83,35.56 40.39,32 40.39,24.13 45.72,18.8 46.23,18.8 R14.1 | IC1.10 16.51,38.1 13.97,40.64 JP9.7 | JP9.7 JP9.9 JP9.11 | JP9.7 JP9.5 | R12.1 48.26,5.33 50.8,7.87 50.8,13.97 R10.1 | OK2.2 57.15,71.37 58.67,69.85 v58.67,68.33 58.93,68.07 58.93,67.82 60.45,66.29 60.45,60.2 68.58,52.07 70.87,52.07 71.63,51.31 71.63,50.04 C3.2 | T2.1 68.58,20.32 Q1.1 | JP6.8 84.07,30.48 77.72,36.83 77.72,39.62 R1.1 | v11.68,81.28 11.68,81.53 14.73,84.58 30.73,84.58 31.24,85.09 33.27,85.09 35.05,83.31 39.62,83.31 40.64,82.3 v48.01,82.3 | R9.1 52.58,27.94 55.63,30.99 v58.93,30.99 | v103.63,79.5 106.68,76.45 | v85.34,78.74 73.41,78.74 72.39,79.76 70.87,79.76 68.33,77.22 64.01,77.22 v63.75,76.96 | v110.24,43.18 95,43.18 94.49,42.67 v94.49,42.42
N$1  (via drill 0.13)
  Top 0.889: v131.06,75.18 133.1,73.15 133.1,69.85 131.83,68.58 129.79,68.58 129.29,68.07 129.29,62.74 131.06,60.96 132.08,60.96 U$1.OUT
  Bottom 0.889: v131.06,75.18 126.49,79.76 117.35,79.76 117.09,79.5 112.01,79.5 109.22,76.71 SK1.10
N$2
  Top 0.889: D1.A D2.K
N$3  (via drill 0.13)
  Top 0.889: v76.71,21.34 v76.71,10.67
  Bottom 0.889: v76.71,10.67 D1.K | v76.71,21.34 76.71,21.59 73.66,24.64 73.66,26.92 71.37,29.21 Q1.3
N$4  (via drill 0.13)
  Top 0.889: Q1.2 74.93,26.67 R1.2 | SK1.7 106.68,70.87 113.03,64.52 116.84,64.52 v118.62,62.74 | v118.62,58.93 118.62,58.67 120.14,57.15 120.14,55.37 123.95,51.56 125.98,51.56 127.25,50.29 v127.25,30.23 | v85.6,24.64 85.34,24.89 82.3,24.89 v82.04,24.64
  Bottom 0.889: v118.62,58.93 v118.62,62.74 | v127.25,30.23 124.46,27.43 100.08,27.43 98.55,25.91 90.93,25.91 89.66,24.64 v85.6,24.64 | v82.04,24.64 82.04,27.94 79.5,30.48 R1.2
N$5
  Bottom 0.889: IC3.1 81.28,52.32 85.34,48.26 88.9,48.26 IC5.28
N$6
  Bottom 0.889: IC3.2 83.82,52.07 86.11,49.78 90.93,49.78 92.71,48.01 IC5.27
N$7  (via drill 0.13)
  Top 0.889: v85.6,43.18 85.6,50.29 86.36,51.05 IC3.3
  Bottom 0.889: IC5.26 95.25,45.72 91.95,42.42 86.36,42.42 v85.6,43.18
N$8
  Top 0.889: IC5.25 97.79,48.26 95.5,50.55 90.68,50.55 88.9,52.32 IC3.4
N$9  (via drill 0.13)
  Top 0.889: v101.6,34.04 101.85,34.04 103.89,36.07 105.92,36.07 107.95,38.1 IC5.8
  Bottom 0.889: OK3.1 124.46,30.73 122.68,28.96 104.65,28.96 101.6,32 v101.6,34.04
N$10
  Bottom 0.889: OK3.4 116.84,32.77 113.03,36.58 106.43,36.58 105.41,37.59 IC5.7
N$11
  Bottom 0.889: OK3.5 114.3,33.02 112.27,35.05 105.66,35.05 102.87,37.85 IC5.6
N$12
  Bottom 0.889: OK3.8 100.33,38.1 IC5.5
N$13
  Top 0.889: IC5.1 90.17,36.58 88.9,35.31 JP6.7
N$14
  Top 0.889: IC5.2 92.71,36.32 91.44,35.05 JP6.5
N$15
  Top 0.889: IC5.3 95.25,36.58 93.98,35.31 JP6.3
N$16
  Top 0.889: IC5.4 97.79,34.29 JP6.1
N$17  (via drill 0.13)
  Top 0.889: JP9.12 R2.1 | IC2.17 44.45,30.48 45.97,28.96 45.97,22.1 41.66,17.78 36.83,17.78 35.31,19.3 v35.31,19.56 | v32.77,27.18 32.51,27.18 22.61,37.08 22.61,48.77 24.38,50.55 v24.64,50.55
  Bottom 0.889: v35.31,19.56 35.31,20.83 32.51,23.62 32.51,26.92 v32.77,27.18 | v24.64,50.55 25.15,51.05 25.15,53.09 21.59,56.64 21.59,59.44 21.34,59.69 JP9.12
N$18  (via drill 0.13)
  Top 0.889: v125.98,54.86 125.98,56.64 124.21,58.42 JP7.2
  Bottom 0.889: IC5.15 123.19,48.26 125.98,51.05 v125.98,54.86
N$19
  Top 0.889: IC5.16 120.65,52.58 118.62,54.61 118.62,56.39 116.59,58.42 JP8.2
N$20
  Top 0.889: JP9.2 R7.1
  Bottom 0.889: IC1.15 10.16,48.77 4.32,54.61 3.56,54.61 1.52,56.64 1.52,61.98 3.3,63.75 5.33,63.75 R7.1
N$21  (via drill 0.13)
  Top 0.889: IC4.1 109.22,82.04 114.81,76.45 116.33,76.45 v116.59,76.2
  Bottom 0.889: v116.59,76.2 122.17,76.2 124.46,73.91 SK1.22
N$22  (via drill 0.13)
  Top 0.889: IC1.16 7.87,45.72 1.52,52.07 1.52,55.63 v3.3,57.4
  Bottom 0.889: v3.3,57.4 3.05,57.66 3.05,61.21 4.06,62.23 6.6,62.23 8.89,64.52 R6.1 JP9.4
N$23
  Bottom 0.889: IC5.24 100.33,48.01 97.79,50.55 92.46,50.55 91.44,51.56 IC3.5
N$24  (via drill 0.13)
  Top 0.889: IC4.2 111.76,81.79 115.57,77.98 v118.36,77.98 | v123.19,77.72 122.94,77.72 119.38,74.17 SK1.18
  Bottom 0.889: v118.36,77.98 118.62,77.72 v123.19,77.72
N$25  (via drill 0.13)
  Top 0.889: IC1.17 11.18,43.18 14.99,46.99 14.99,49.02 16.76,50.8 20.07,50.8 26.16,56.9 26.16,58.42 28.19,60.45 v29.21,60.45 | v25.65,77.47 v30.48,72.64
  Bottom 0.889: v29.21,60.45 32.51,63.75 32.51,70.1 30.99,71.63 30.99,71.88 30.48,72.39 v30.48,72.64 | v25.65,77.47 6.1,77.47 3.81,75.18 3.81,72.64 11.43,65.02 R5.1 JP9.6
N$26
  Top 0.889: IC4.3 114.3,84.84 112.52,86.61 110.49,86.61 109.47,87.63 104.39,87.63 103.38,88.65 103.38,91.95 107.19,95.76 108.46,95.76 JP1.2
N$27  (via drill 0.13)
  Top 0.889: IC4.6 121.92,86.11 122.68,86.87 123.95,86.87 125.73,88.65 127.76,88.65 129.54,90.42 129.54,92.46 127.25,94.74 120.4,94.74 v119.13,96.01
  Bottom 0.889: v119.13,96.01 118.87,95.76 115.06,95.76 JP1.1
N$28
  Top 0.889: IC4.14 114.3,93.73 118.87,98.3 121.41,98.3 JP2.1
N$29  (via drill 0.13)
  Top 0.889: v128.27,86.87 131.06,89.66 131.06,93.22 128.02,96.27 125.98,96.27 JP2.2
  Bottom 0.889: IC4.11 121.92,89.15 122.94,88.14 126.24,88.14 127.51,86.87 v128.27,86.87
N$30
  Top 0.889: IC4.7 124.46,81.53 116.84,73.91 SK1.16
N$31
  Bottom 0.889: IC5.23 102.87,49.78 104.14,51.05 104.14,53.85 103.63,54.36 103.63,54.86 101.85,56.64 95,56.64 93.98,55.63 IC3.6
N$32  (via drill 0.13)
  Top 0.889: v91.44,79.76 88.65,76.96 v88.65,73.41
  Bottom 0.889: IC4.15 111.76,92.46 105.92,98.3 93.47,98.3 91.19,96.01 91.19,84.07 92.71,82.55 92.71,81.03 v91.44,79.76 | v88.65,73.41 88.65,70.36 90.17,68.83 91.69,68.83 93.73,66.8 94.49,66.8 96.27,65.02 100.08,65.02 103.63,68.58 109.47,68.58 111.76,70.87 SK1.11
N$33  (via drill 0.13)
  Top 0.889: v49.53,61.98 49.78,62.23 51.82,62.23 53.09,60.96 59.44,60.96 59.69,60.71 59.69,57.91 57.66,55.88 JP4.13
  Bottom 0.889: IC2.2 37.08,55.88 42.16,60.96 43.69,60.96 45.21,62.48 49.02,62.48 v49.53,61.98
N$34  (via drill 0.13)
  Top 0.889: JP3.4 v36.83,3.56
  Bottom 0.889: IC1.22 9.14,30.48 5.84,27.18 5.84,24.13 2.79,21.08 2.79,12.19 13.46,1.52 34.8,1.52 v36.83,3.56
N$35  (via drill 0.13)
  Top 0.889: IC4.10 124.46,89.66 123.19,88.39 v119.89,88.39 | v102.36,64.77 v97.28,69.85
  Bottom 0.889: v119.89,88.39 119.63,88.14 116.08,88.14 115.82,88.39 109.73,88.39 95.76,74.42 95.76,71.37 v97.28,69.85 | v102.36,64.77 102.36,65.02 104.39,67.06 110.24,67.06 112.27,69.09 112.52,69.09 114.3,70.87 SK1.13
N$36  (via drill 0.13)
  Top 0.889: v122.17,68.58 119.13,68.58 116.84,70.87 SK1.15
  Bottom 0.889: IC4.9 133.1,85.34 133.1,69.85 131.83,68.58 v122.17,68.58
N$37
  Top 0.889: IC5.22 105.41,48.01 102.87,50.55 97.79,50.55 96.52,51.82 IC3.7
N$38  (via drill 0.13)
  Top 0.889: v105.41,55.12 104.65,55.12 103.63,56.13 100.84,56.13 99.06,54.36 IC3.8
  Bottom 0.889: IC5.21 107.95,52.58 v105.41,55.12
N$39  (via drill 0.13)
  Top 0.889: IC1.21 11.18,33.02 13.21,30.99 v13.21,7.37 | v15.75,4.83 16,4.57 24.64,4.57 25.15,5.08 29.46,5.08 v29.97,4.57
  Bottom 0.889: v13.21,7.37 13.46,7.37 15.75,5.08 v15.75,4.83 | v29.97,4.57 30.23,4.83 32.77,4.83 34.29,6.35 37.08,6.35 39.37,8.64 JP3.2
N$40  (via drill 0.13)
  Top 0.889: IC2.15 41.4,25.4 37.34,21.34 33.78,21.34 29.46,25.65 v29.21,25.65 | v29.21,71.12 19.81,71.12 13.97,65.28 R4.1 JP9.8
  Bottom 0.889: v29.21,25.65 29.46,25.91 29.46,28.7 30.73,29.97 30.73,39.62 28.45,41.91 28.45,54.36 24.64,58.17 24.64,59.18 28.45,62.99 29.46,62.99 30.99,64.52 30.99,69.34 v29.21,71.12
N$41  (via drill 0.13)
  Top 0.889: v14.48,3.3 14.73,3.05 25.65,3.05 v25.91,3.3
  Bottom 0.889: IC1.23 9.14,27.94 7.37,26.16 7.37,23.37 4.32,20.32 4.32,12.95 13.97,3.3 v14.48,3.3 | v25.91,3.3 27.94,5.33 28.19,5.33 29.21,6.35 32,6.35 34.29,8.64 JP3.6
N$42
  Top 0.889: IC1.24 9.14,25.4 7.37,23.62 7.37,7.87 13.72,1.52 29.46,1.52 31.75,3.81 JP3.8
N$43  (via drill 0.13)
  Top 0.889: JP9.10 R3.1 | IC2.16 42.16,27.94 40.13,29.97 40.13,43.18 38.61,44.7 v38.61,60.2 | v34.29,68.83 37.85,72.39 37.85,75.44 41.4,78.99 41.4,79.5 45.97,84.07 v46.23,84.07 | v4.83,69.09 5.08,68.83 12.19,68.83 v12.45,69.09
  Bottom 0.889: v38.61,60.2 34.04,64.77 34.04,68.58 v34.29,68.83 | v46.23,84.07 45.97,83.82 41.4,83.82 40.39,84.84 38.35,84.84 38.1,85.09 35.56,85.09 34.04,86.61 30.48,86.61 29.97,86.11 13.97,86.11 6.86,78.99 5.33,78.99 2.29,75.95 2.29,71.88 4.83,69.34 v4.83,69.09 | v12.45,69.09 16.51,65.02 R3.1
N$44
  Bottom 0.889: IC1.25 9.14,22.86 5.84,19.56 5.84,13.72 10.41,9.14 13.97,9.14 20.07,3.05 23.11,3.05 25.4,5.33 25.65,5.33 27.18,6.86 27.43,6.86 29.21,8.64 JP3.10
N$45
  Bottom 0.889: IC1.26 8.89,20.32 7.37,18.8 7.37,14.48 11.18,10.67 14.73,10.67 20.83,4.57 22.35,4.57 24.64,6.86 24.89,6.86 26.67,8.64 JP3.12
N$46
  Bottom 0.889: IC1.27 11.18,17.78 15.24,13.72 15.24,12.45 21.34,6.35 21.84,6.35 24.13,8.64 JP3.14
N$47
  Top 0.889: IC1.28 10.16,7.37 11.94,5.59 13.97,5.59 17.27,8.89 JP3.16
N$48
  Top 0.889: IC1.2 20.83,17.78 24.13,14.48 JP3.13
N$49
  Top 0.889: JP3.15 IC1.1
N$50
  Top 0.889: IC1.3 20.57,20.32 26.67,14.22 JP3.11
N$51
  Top 0.889: IC1.4 20.32,22.86 29.21,13.97 JP3.9
N$52
  Top 0.889: IC1.5 20.07,25.4 31.75,13.72 JP3.7
N$53
  Top 0.889: IC1.6 19.81,27.94 34.29,13.46 JP3.5
N$54
  Top 0.889: IC1.7 19.56,30.48 36.83,13.21 JP3.3
N$55
  Bottom 0.889: IC1.8 20.32,33.02 21.84,31.5 21.84,25.91 33.78,13.97 36.83,13.97 37.34,13.46 37.59,13.46 39.37,11.68 JP3.1
N$56
  Top 0.889: JP4.2 IC2.21
N$57
  Top 0.889: JP4.4 IC2.22
N$58
  Top 0.889: JP4.6 IC2.23
N$59
  Top 0.889: JP4.8 IC2.24
N$60
  Top 0.889: JP4.10 IC2.25
N$61
  Top 0.889: JP4.12 IC2.26
N$62
  Top 0.889: JP4.14 IC2.27
N$63
  Top 0.889: JP4.16 IC2.28
N$64  (via drill 0.13)
  Top 0.889: IC2.1 35.56,59.69 38.35,62.48 39.37,62.48 v39.62,62.23
  Bottom 0.889: v39.62,62.23 41.15,62.23 41.4,62.48 42.93,62.48 44.45,64.01 50.04,64.01 53.34,60.71 55.12,60.71 57.15,58.67 JP4.15
N$65  (via drill 0.13)
  Top 0.889: IC2.3 34.54,53.34 30.99,56.9 30.99,59.94 36.58,65.53 38.61,65.53 39.37,66.29 39.37,74.68 45.21,80.52 47.5,80.52 51.82,76.2 54.61,76.2 v54.86,75.95 | v62.99,64.01 62.74,64.01 61.21,62.48 61.21,57.15 57.4,53.34 JP4.11
  Bottom 0.889: v54.86,75.95 55.12,76.2 57.4,76.2 58.42,77.22 60.96,77.22 62.99,75.18 v62.99,64.01
N$66
  Bottom 0.889: IC3.18 80.01,62.23 78.23,62.23 69.85,70.61 JP5.1
N$67  (via drill 0.13)
  Top 0.889: IC2.4 26.92,50.8 25.4,52.32 23.88,52.32 21.08,49.53 21.08,31.24 36.07,16.26 v43.18,16.26
  Bottom 0.889: v43.18,16.26 44.2,15.24 46.74,15.24 50.55,19.05 53.09,19.05 59.44,25.4 59.94,25.4 62.23,27.69 62.23,30.23 59.69,32.77 59.69,34.54 60.71,35.56 60.71,36.83 62.74,38.86 62.74,45.47 57.4,50.8 JP4.9
N$68  (via drill 0.13)
  Top 0.889: IC2.5 33.27,48.26 27.69,42.67 27.69,40.39 28.19,39.88 28.19,35.56 v27.43,34.8 | v27.69,29.46 27.94,29.46 34.54,22.86 36.32,22.86 v36.58,23.11 | v39.12,20.57 42.16,20.57 44.2,22.61 v44.2,22.86
  Bottom 0.889: v27.43,34.8 26.42,33.78 26.42,30.73 v27.69,29.46 | v39.12,20.57 v36.58,23.11 | v44.2,22.86 55.88,34.54 57.4,34.54 59.18,36.32 59.18,37.59 61.21,39.62 61.21,41.4 60.96,41.66 60.96,44.96 57.66,48.26 JP4.7
N$69  (via drill 0.13)
  Top 0.889: v40.39,48.26 40.13,48.51 40.13,59.18 41.91,60.96 44.96,60.96 45.47,60.45 v45.47,60.2 | v56.13,36.32 56.39,36.58 58.17,36.58 61.21,39.62 61.21,41.91 57.4,45.72 JP4.5
  Bottom 0.889: IC2.6 37.85,45.72 v40.39,48.26 | v45.47,60.2 45.97,59.69 45.97,41.66 51.05,36.58 55.88,36.58 v56.13,36.32
N$70  (via drill 0.13)
  Top 0.889: IC2.7 37.85,43.18 38.61,42.42 v38.61,27.94 | v45.21,17.02 46.99,17.02 49.02,19.05 51.05,19.05 54.61,22.61 54.61,31.24 52.07,33.78 52.07,35.31 54.86,38.1 57.4,38.1 59.69,40.39 59.69,41.15 57.66,43.18 JP4.3
  Bottom 0.889: v38.61,27.94 38.61,27.69 38.35,27.43 38.35,23.88 v45.21,17.02
N$71  (via drill 0.13)
  Top 0.889: v32.77,59.18 37.59,64.01 40.39,64.01 41.91,62.48 45.72,62.48 v47.5,60.71
  Bottom 0.889: IC2.8 32,40.64 29.97,42.67 29.97,56.39 v32.77,59.18 | v47.5,60.71 47.5,42.42 51.82,38.1 54.86,38.1 57.15,40.39 JP4.1
N$72
  Bottom 0.889: IC3.17 83.82,62.23 82.3,63.75 78.99,63.75 72.39,70.36 JP5.3
N$73
  Bottom 0.889: IC3.16 86.36,61.98 83.06,65.28 80.01,65.28 74.93,70.36 JP5.5
N$74
  Bottom 0.889: IC3.15 88.9,63.25 87.88,64.26 86.36,64.26 83.82,66.8 80.77,66.8 77.47,70.1 JP5.7
N$75
  Bottom 0.889: IC3.14 91.44,58.67 90.42,57.66 79.76,57.66 76.45,60.96 76.45,61.72 67.31,70.87 67.31,71.37 69.6,73.66 JP5.2
N$76  (via drill 0.13)
  Top 0.889: IC5.13 120.65,40.89 125.73,45.97 125.73,49.53 125.22,50.04 v122.43,50.04 | v114.05,53.85 112.78,55.12 v112.78,62.74
  Bottom 0.889: v122.43,50.04 117.86,50.04 v114.05,53.85 | v112.78,62.74 118.62,68.58 119.63,68.58 121.92,70.87 SK1.19
N$77  (via drill 0.13)
  Top 0.889: v128.02,58.93 128.02,59.18 126.24,60.96 126.24,67.31 124.46,69.09 SK1.21
  Bottom 0.889: IC5.14 123.19,39.88 130.81,47.5 131.06,47.5 133.1,49.53 133.1,53.85 v128.02,58.93
N$78  (via drill 0.13)
  Top 0.889: v130.3,49.28 130.3,59.18 127.76,61.72 127.76,68.07 127,68.83 SK1.23
  Bottom 0.889: IC5.12 118.11,40.39 121.92,44.2 125.22,44.2 v130.3,49.28
N$79  (via drill 0.13)
  Top 0.889: IC5.11 115.57,37.08 115.06,36.58 108.71,36.58 106.68,34.54 104.65,34.54 98.04,27.94 84.58,27.94 v83.82,28.7 | v68.58,75.44 68.83,75.44 69.09,75.69 71.12,75.69 71.63,76.2 75.44,76.2 76.96,77.72 83.06,77.72 83.82,76.96 v86.87,76.96 | v105.16,89.41 105.16,91.44 107.95,94.23 v112.52,94.23 | v132.59,94.23 133.1,93.73 133.1,80.01 127,73.91 SK1.24
  Bottom 0.889: v83.82,28.7 83.57,28.7 76.2,36.07 76.2,45.47 73.66,48.01 73.66,49.28 73.15,49.78 73.15,56.39 70.61,58.93 70.61,59.69 64.52,65.79 64.52,70.87 67.31,73.66 67.31,74.17 v68.58,75.44 | v86.87,76.96 88.65,76.96 89.66,77.98 94.74,77.98 105.16,88.39 v105.16,89.41 | v132.59,94.23 v112.52,94.23
N$80  (via drill 0.13)
  Top 0.889: IC3.13 93.98,58.67 93.47,58.17 78.99,58.17 77.98,57.15 73.41,57.15 70.61,59.94 70.61,64.01 71.63,65.02 71.63,66.55 66.29,71.88 66.29,75.69 67.82,77.22 70.36,77.22 71.12,77.98 v71.63,77.98
  Bottom 0.889: v71.63,77.98 71.63,76.71 72.39,75.95 JP5.4
N$81
  Bottom 0.889: IC3.12 96.52,63.25 96.27,63.5 95.5,63.5 93.73,65.28 92.96,65.28 90.93,67.31 88.14,67.31 87.12,68.33 87.12,71.37 81.28,77.22 76.2,77.22 74.93,75.95 JP5.6
N$82  (via drill 0.13)
  Top 0.889: IC3.11 99.06,61.98 97.28,63.75 v91.95,63.75 | v82.55,73.41 82.55,75.95 82.3,76.2 77.72,76.2 77.47,75.95 JP5.8
  Bottom 0.889: v91.95,63.75 91.95,64.01 90.17,65.79 87.38,65.79 85.6,67.56 85.6,70.61 82.8,73.41 v82.55,73.41
N$83  (via drill 0.6)
  other vias: 107.95,3.81
N$84  (via drill 0.13)
  Top 0.889: OK3.2 121.92,30.23 128.78,23.37 v128.78,10.41 | v106.17,17.02 106.17,17.27 100.58,22.86 v100.33,22.86 | v72.14,17.02 61.21,27.94 R9.2
  Bottom 0.889: v128.78,10.41 122.17,10.41 121.41,9.65 119.89,9.65 116.33,13.21 109.98,13.21 v106.17,17.02 | v100.33,22.86 92.46,22.86 86.36,16.76 81.53,16.76 81.03,17.27 74.93,17.27 74.68,17.02 v72.14,17.02
N$85  (via drill 0.13)
  Top 0.889: OK3.6 111.76,34.04 112.78,35.05 124.71,35.05 v125.22,34.54 | v127,13.72 125.98,12.7 121.92,12.7 121.41,13.21 121.16,13.21 120.9,13.46 120.4,13.46 120.14,13.21 119.89,13.21 118.11,11.43 110.24,11.43 107.95,13.72 107.95,17.78 v100.84,24.89
  Bottom 0.889: v125.22,34.54 125.48,34.54 130.05,29.97 130.05,15.49 128.27,13.72 v127,13.72 | v100.84,24.89 99.82,24.89 99.31,24.38 91.69,24.38 85.6,18.29 82.3,18.29 77.22,23.37 77.22,25.65 72.9,29.97 72.9,30.23 71.37,31.75 68.58,31.75 R11.2
N$86  (via drill 0.13)
  Top 0.889: v120.65,11.43 119.13,9.91 109.47,9.91 108.46,10.92 101.85,10.92 96.52,16.26 91.69,16.26 87.63,12.19 87.63,6.1 84.58,3.05 78.49,3.05 70.36,11.18 62.23,11.18 v61.98,10.92 | v61.98,14.48 61.72,14.22 58.17,14.22 R10.2
  Bottom 0.889: OK3.3 119.38,32.77 122.94,36.32 125.98,36.32 131.57,30.73 131.57,14.73 129.03,12.19 128.02,12.19 127.76,11.94 121.16,11.94 v120.65,11.43 | v61.98,14.48 v61.98,10.92
N$87
  Top 0.889: OK3.16 125.73,24.13 127.25,22.61 127.25,16.51 125.98,15.24 SV2.5
N$88  (via drill 0.13)
  Top 0.889: v116.84,14.99 OK3.13
  Bottom 0.889: v116.84,14.99 119.13,12.7 119.38,12.7 119.89,13.21 120.14,13.21 121.92,14.99 SV2.3
N$89  (via drill 0.13)
  Top 0.889: v114.3,18.03 OK3.12
  Bottom 0.889: v114.3,18.03 116.33,18.03 119.13,15.24 SV2.1
N$90
  Bottom 0.889: OK3.9 106.68,22.86 85.34,1.52 47.75,1.52 45.72,3.56 45.72,7.11 47.62,9.02 | 47.62,9.02 48.26,9.65 R13.1 | 47.62,9.02 45.21,11.43 R14.2
N$91
  Bottom 0.889: R13.2 60.2,14.48 60.2,17.27 63.25,20.32 63.5,20.32 64.26,19.56 64.77,19.56 T2.2
N$92  (via drill 0.13)
  Top 0.889: D4.A 78.49,26.42 93.98,26.42 97.79,22.61 LED1.K 97.79,19.56 101.85,15.49 v102.11,15.49
  Bottom 0.889: T2.3 64.26,17.02 64.26,16.76 65.79,15.24 67.31,15.24 D4.A | v102.11,15.49 101.85,15.24 101.85,6.86 104.39,4.32 104.39,1.78 K2.2
N$93
  Bottom 1.676: K2.C 131.44,7.62 131.52,7.54 J4.1
N$94  (via drill 0.13)
  Top 0.889: OK3.7 109.22,30.23 v104.14,25.15 | v95,13.72 95,11.18 85.34,1.52 58.17,1.52 R12.2
  Bottom 0.889: v104.14,25.15 104.14,22.61 95.25,13.72 v95,13.72
N$95  (via drill 0.6)
  Top 0.813: v107.95,3.81 v99.06,3.81
  Bottom 0.813: J5.2 v107.95,3.81 | v99.06,3.81 92.29,3.81 K2.NC
N$96
  Bottom 1.676: J5.1 116.28,2.54 127,2.54 127.56,3.1 J4.2
N$97
  Bottom 0.889: OK3.11 111.76,23.11 115.32,19.56 117.09,19.56 118.87,17.78 SV2.2
N$98
  Bottom 0.889: OK3.14 119.38,20.57 121.92,18.03 SV2.4
N$99
  Bottom 0.889: OK3.15 121.92,22.61 124.46,20.07 SV2.6
N$100  (via drill 0.6)
  other vias: 99.06,3.81
N$101  (via drill 0.6)
  other vias: 2.69,2.39
N$102
  Bottom 0.889: B1.AC1 28.7,98.3 21.08,98.3 7.37,84.58 6.35,84.58 J3.2
N$103  (via drill 0.5 pad 1.27)
  Top 0.61: v13.97,98.42 18.41,98.42 v22.23,94.62
  Bottom 0.61: v13.97,98.42 12.78,97.23 J1.1 | B1.AC2 v22.23,94.62
N$104  (via drill 0.13)
  Top 0.889: v74.17,93.98 74.17,93.73 69.6,89.15 61.21,89.15 58.93,91.44 v58.93,91.95
  Bottom 0.889: B1.+ 29.21,92.71 34.04,92.71 | 34.04,92.71 40.39,86.36 D8.A | v74.17,93.98 Q2.2 | v58.93,91.95 58.67,91.95 58.17,92.46 56.13,92.46 50.29,98.3 37.59,98.3 34.29,95 34.29,92.96 34.04,92.71
N$105
  Top 0.889: R17.1 R16.2
N$106  (via drill 0.5 pad 1.27)
  Top 0.889: R8.1 59.44,86.36 v64.52,81.28
  Bottom 0.61: v64.52,81.28 CX2.1
  Bottom 0.889: R16.1 82.3,81.28 79.76,83.82 69.85,83.82 CX2.1
N$107  (via drill 0.13)
  Top 0.889: R15.2 20.57,80.01 21.84,81.28 21.84,81.53 26.92,86.61 34.04,86.61 36.83,83.82 43.43,83.82 45.47,85.85 47.75,85.85 49.78,83.82 52.58,83.82 54.61,85.85 54.61,86.61 56.9,88.9 59.18,88.9 60.45,87.63 60.96,87.63 | 60.96,87.63 65.79,87.63 67.82,85.6 70.61,85.6 76.45,91.44 Q2.1 | v60.96,87.38 60.96,87.63
  Bottom 0.889: OK2.4 59.69,86.11 v60.96,87.38
N$108  (via drill 0.6)
  other vias: 2.39,38.66
N$109
  Top 0.889: R8.2 57.15,91.44 D8.C
N$110
  Top 0.889: C6.+ 93.98,95.25 D9.C 87.38,88.65 87.38,87.38 R17.2 75.95,85.09 69.6,78.74 57.66,78.74 57.15,79.25 OK2.5
N$111  (via drill 0.13)
  Top 0.889: v90.93,81.79 91.95,81.79 96.52,77.22 98.04,77.22 99.06,76.2 109.47,76.2 111.76,73.91 SK1.12
  Bottom 0.889: R18.2 53.59,92.71 55.37,90.93 57.4,90.93 59.18,89.15 81.28,89.15 82.8,87.63 85.34,87.63 90.93,82.04 v90.93,81.79
N$112
  Bottom 0.889: OK2.1 49.78,78.49 49.78,83.06 40.13,92.71 R18.1
N$113
  Bottom 1.676: J1.2 J3.1
N$114
  Top 0.889: JP10.1 92.46,72.39 95.76,75.69 97.28,75.69 99.06,73.91 SK1.2
N$115  (via drill 0.6)
  other vias: 132.54,41.4
N$116  (via drill 0.6)
  other vias: 133.15,98.4
N$117  (via drill 0.13)
  Top 0.889: Q5.1 40.89,72.64 40.89,65.79 42.67,64.01 46.48,64.01 46.74,63.75 52.58,63.75 53.34,62.99 v53.59,62.99 | 78.74,44.2 80.26,44.2 80.52,44.45 82.3,44.45 R21.2 | 78.74,44.2 v74.42,44.2 | SK1.5 104.14,67.82 106.68,65.28 v106.93,65.28 | v103.38,57.91 95.5,57.91 94.23,56.64 79.76,56.64 78.74,55.63 78.74,44.2
  Bottom 0.889: v53.59,62.99 53.59,62.74 54.1,62.23 55.88,62.23 57.66,60.45 57.91,60.45 66.04,52.32 66.04,49.28 69.09,46.23 73.15,46.23 74.42,44.96 v74.42,44.2 | v106.93,65.28 106.93,61.47 v103.38,57.91
N$118  (via drill 0.13)
  Top 0.889: Q3.1 46.48,66.55 46.48,66.29 47.5,65.28 52.58,65.28 54.61,67.31 v56.9,67.31 | v58.67,63.5 59.94,63.5 62.23,65.79 v69.85,65.79 | v97.03,66.8 92.96,66.8 91.69,65.53 80.77,65.53 R22.2
  Bottom 0.889: v56.9,67.31 57.15,67.31 58.93,65.53 58.93,64.01 58.67,63.75 v58.67,63.5 | v69.85,65.79 70.1,65.79 74.93,60.96 R22.2 | SK1.3 101.6,68.83 99.31,66.55 97.28,66.55 v97.03,66.8
N$119  (via drill 0.13, 0.5 pad 1.27)
  Top 0.61: 35.05,93.47 34.92,93.34 v34.92,88.27
  Top 0.889: D9.A C6.- 97.79,97.54 97.03,98.3 85.6,98.3 Q2.3 82.55,96.52 78.99,92.96 75.69,92.96 70.1,87.38 v68.58,87.38 | 35.05,93.47 35.05,93.73 36.32,95 v36.83,95
  Bottom 0.61: v34.92,88.27 33.02,90.17 B1.-
  Bottom 0.889: R15.1 21.84,90.17 24.38,87.63 29.21,87.63 B1.- | CX2.2 76.45,82.3 70.61,82.3 69.85,81.53 69.85,81.03 67.56,78.74 65.02,78.74 62.23,78.99 | 62.23,78.99 62.23,82.93 v68.58,87.38 | v36.83,95 37.08,95.25 39.88,95.25 51.31,83.82 51.31,79.25 52.83,77.72 56.64,77.72 57.66,78.74 61.34,78.74 62.23,78.99
N$120  (via drill 0.13)
  Top 0.889: IC2.13 34.54,27.94 v28.96,33.53 | R20.1 26.67,61.21 24.64,59.18 24.64,57.66 19.56,52.58 v19.3,52.58
  Bottom 0.889: R20.1 26.67,71.37 32,76.71 38.61,76.71 42.67,72.64 46.23,72.64 49.53,69.34 49.53,68.58 Q3.3 | v28.96,33.53 29.21,33.78 29.21,38.86 22.35,45.72 20.57,45.72 | IC1.13 20.57,45.72 | v19.3,52.58 19.3,51.56 20.57,50.29 20.57,45.72
N$121  (via drill 0.13)
  Top 0.889: v24.13,68.83 24.13,66.8 23.11,65.79 v23.11,62.48 | v26.67,46.48 26.16,45.97 26.16,39.37 v26.42,39.12
  Bottom 0.889: Q5.3 46.99,75.95 45.21,74.17 43.94,74.17 43.69,74.42 43.18,74.42 39.37,78.23 37.85,78.23 33.53,82.55 R19.1 32,81.53 32,78.99 24.13,71.12 v24.13,68.83 | IC1.12 18.8,43.18 24.64,37.34 | 24.64,37.34 24.89,37.08 24.89,27.43 28.45,23.88 29.97,23.88 30.99,24.89 30.99,27.94 33.53,30.48 IC2.12 | v23.11,62.48 23.11,57.4 26.67,53.85 v26.67,46.48 | 24.64,37.34 v26.42,39.12
N$122  (via drill 0.6)
  other vias: 42.32,1.47
N$123  (via drill 0.6)
  other vias: 0.86,97.79
VCC  (via drill 0.13, 0.5 pad 1.27)
  Top 0.61: 101.6,13.46 102.87,12.07 106.68,12.07 106.04,15.24 v104.39,16.21 | 83.57,18.03 84.45,17.14 v84.45,14.93
  Top 0.889: v72.9,60.45 79.5,67.06 90.93,67.06 v94.23,70.36 | v115.06,86.61 114.81,86.61 113.28,88.14 111.25,88.14 109.22,90.17 IC4.16 | R7.2 R6.2 R5.2 R4.2 R3.2 R2.2 19.3,75.18 20.83,75.18 24.89,79.25 26.42,79.25 33.02,72.64 R19.2 | v49.53,71.88 49.28,71.63 43.43,71.63 v42.67,70.87 | 95.25,18.03 LED1.A | 95.25,18.03 95.5,17.78 97.28,17.78 101.6,13.46 | C3.1 66.04,46.99 C4.1 65.79,40.39 64.26,40.39 56.13,32.26 56.13,25.4 | D4.C 83.82,18.29 83.57,18.03 83.82,17.78 95,17.78 95.25,18.03 | 80.01,14.48 J2.3 | 56.13,25.4 56.13,21.84 52.32,18.03 v52.32,17.02 | IC2.18 44.2,33.02 47.5,29.72 47.5,27.69 v49.78,25.4 | v56.39,25.4 56.13,25.4 | v47.24,12.7 50.55,12.7 56.9,6.35 59.69,6.35 D2.A | v21.59,67.06 21.59,63.5 21.34,63.25 21.34,61.72 21.59,61.47 21.59,56.9 19.05,54.36 18.03,54.36 14.48,50.8 9.14,50.8 v7.37,49.02 | v76.96,54.1 77.22,53.85 77.22,47.75 v76.96,47.5
  Bottom 0.61: v104.39,16.21 K2.1 | v84.45,14.93 83.65,14.43 J2.3
  Bottom 0.889: IC3.10 101.6,58.67 101.09,58.17 93.22,58.17 91.19,56.13 78.99,56.13 | 78.99,56.13 77.98,57.15 74.68,57.15 72.39,59.44 72.39,59.94 v72.9,60.45 | v94.23,70.36 94.23,74.42 93.85,74.8 | 93.85,74.8 93.73,74.93 JP10.2 | IC4.16 109.22,90.17 93.85,74.8 | IC4.8 127,85.09 125.48,86.61 v115.06,86.61 | R19.2 34.8,70.61 35.05,70.61 36.83,68.83 R20.2 37.08,69.09 38.86,70.87 v42.67,70.87 | C5.+ 51.05,68.58 51.05,70.1 49.53,71.63 v49.53,71.88 | OK3.10 109.22,23.11 104.39,18.29 v104.39,16.21 104.39,13.72 K2.1 | IC2.18 41.66,33.02 36.58,38.1 IC2.9 | 60.96,7.37 D2.A | 60.96,7.37 67.31,13.72 68.07,13.72 68.83,14.48 80.01,14.48 J2.3 | v52.32,17.02 52.32,8.89 53.59,7.62 60.71,7.62 60.96,7.37 | v56.39,25.4 v49.78,25.4 | v47.24,12.7 46.23,13.72 43.18,13.72 41.4,15.49 34.54,15.49 23.37,26.67 23.37,32.26 20.07,35.56 IC1.9 16.76,35.56 11.68,40.64 IC1.18 9.14,40.64 7.37,42.42 v7.37,49.02 | R2.2 19.05,69.6 v21.59,67.06 | v76.96,54.1 78.99,56.13 | v76.96,47.5 88.9,35.56 96.77,35.56 99.06,33.27 99.06,28.7 97.79,27.43 90.17,27.43 88.9,26.16 86.61,26.16 86.36,26.42 84.84,26.42 83.82,25.4 D4.C
VDD  (via drill 0.13)
  Top 0.889: JP7.3 JP8.3 | SK1.1 99.06,70.36 102.87,66.55 103.12,66.55 110.74,58.93 | 110.74,58.93 111.25,58.42 111.25,54.36 112.27,53.34 112.27,52.58 115.57,49.28 IC5.18 | v111,59.18 110.74,58.93 | 51.31,71.12 50.29,70.1 47.75,70.1 46.99,69.34 Q3.2 | v51.31,74.42 51.31,71.12 | 73.66,50.8 R22.1 64.77,59.94 v68.83,64.01 | 73.66,50.8 73.66,45.97 72.39,44.7 72.39,44.45 R21.1 | v66.29,67.56 63.75,70.1 53.85,70.1 53.09,70.87 51.56,70.87 51.31,71.12 | IC5.9 110.49,40.64 109.73,41.4 109.47,41.4 106.68,44.2 v87.38,44.2 | v74.93,50.55 73.91,50.55 73.66,50.8
  Bottom 0.889: JP7.3 124.97,60.96 130.05,66.04 132.08,66.04 U$1.VCC | IC5.9 110.49,40.89 115.57,45.97 IC5.18 | JP8.3 112.78,60.96 v111,59.18 | v51.31,74.42 48.77,76.96 48.77,77.22 47.24,78.74 46.99,78.74 46.23,77.98 45.72,77.98 Q5.2 | C2.1 62.23,36.07 64.26,38.1 70.87,38.1 72.39,39.62 72.39,44.2 R21.1 | v66.29,67.56 66.29,66.29 68.58,64.01 v68.83,64.01 | v87.38,44.2 86.11,45.47 85.85,45.47 80.77,50.55 v74.93,50.55